# Altium schematic sheet H-BRIDGE.SchDoc
size A
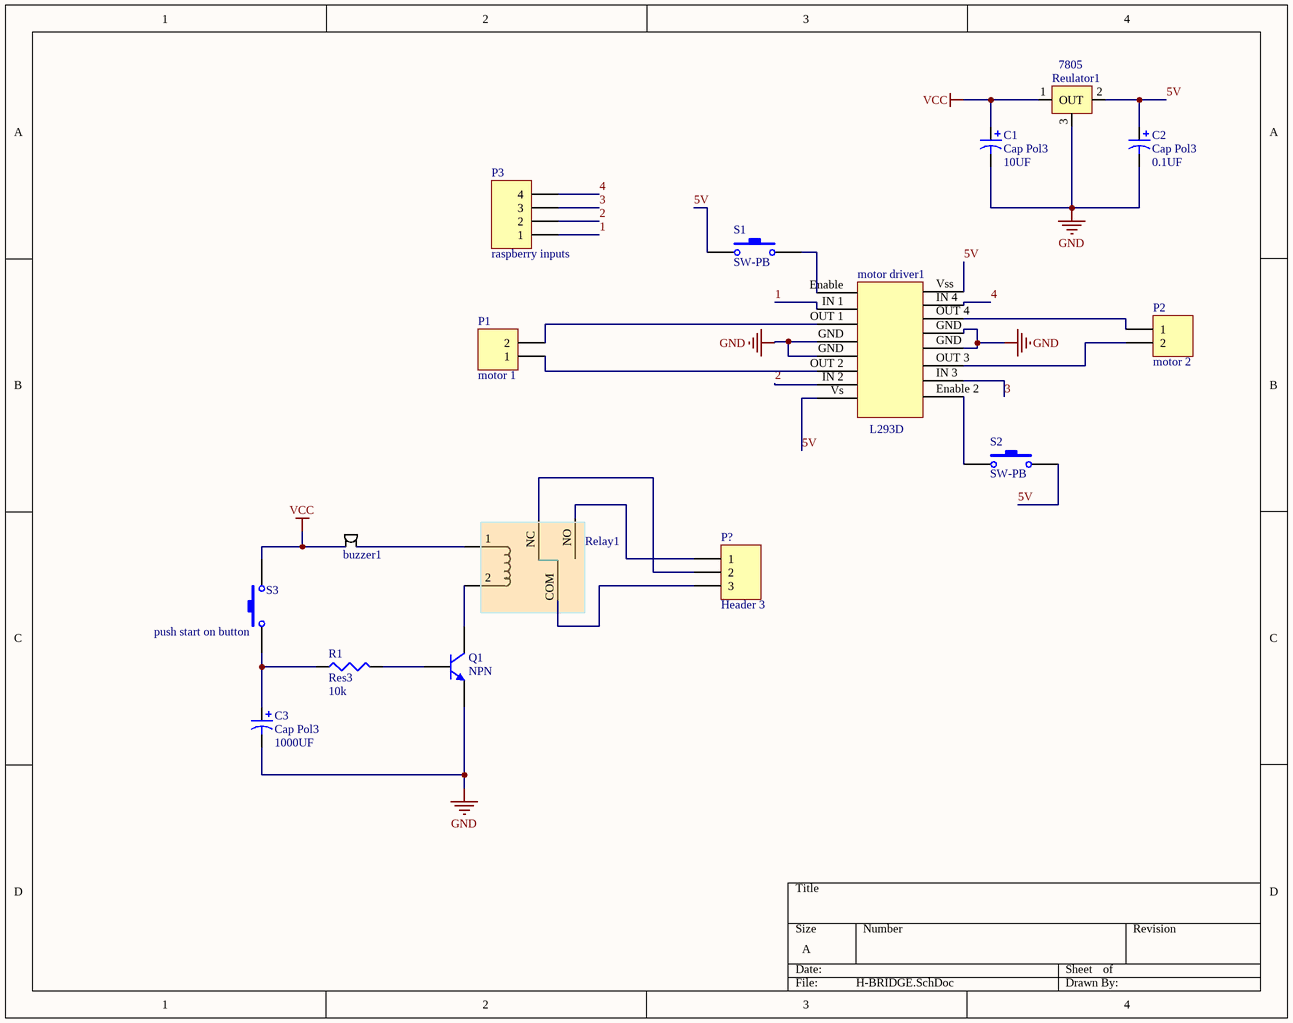
[diagram p0: H-BRIDGE.SchDoc]

## Parts
buzzer1  buzzer  [Buzzer]  (value not drawn)
C1  Cap Pol3  value 10UF  [C0805]
C2  Cap Pol3  value 0.1UF  [C0805]
C3  Cap Pol3  value 1000UF  [C0805]
motor_driver1  L293D  [L293D]
P1  motor 1  [HDR1X2]
P2  motor 2  [HDR1X2]
P3  raspberry inputs  [HDR1X4]
P?  Header 3  [HDR1X3]
Q1  NPN  [TO-226-AA]
R1  Res3  value 10k  [J1-0603]
Relay1  Realy 5v  [Relay 5v]  (value not drawn)
Reulator1  7805  [7805 REGULATOR]
S1  SW-PB  [SPST-2]
S2  SW-PB  [SPST-2]
S3  push start on button  [SPST-2]

## Nets
GND: C1.2 C2.2 C3.2 motor_driver1.GND Q1.3(E) Reulator1.3(BASE)
VCC: buzzer1.+ C1.1 Reulator1.1(IN) S3.2
1: motor_driver1.IN_1 P3.1
2: motor_driver1.IN_2 P3.2
3: motor_driver1.IN_3 P3.3
4: motor_driver1.IN_4 P3.4
5V: C2.1 motor_driver1.Vs motor_driver1.Vss Reulator1.2(OUT) S1.1 S2.2
Netbuzzer1_-: buzzer1.- Relay1.1(coil1)
NetC3_1: C3.1 R1.1 S3.1
Netmotor_driver1_Enable: motor_driver1.Enable S1.2
Netmotor_driver1_Enable 2: motor_driver1.Enable_2 S2.1
Netmotor_driver1_OUT 1: motor_driver1.OUT_1 P1.2
Netmotor_driver1_OUT 2: motor_driver1.OUT_2 P1.1
Netmotor_driver1_OUT 3: motor_driver1.OUT_3 P2.2
Netmotor_driver1_OUT 4: motor_driver1.OUT_4 P2.1
NetP?_1: P?.1 Relay1.NO
NetP?_2: P?.2 Relay1.NC
NetP?_3: P?.3 Relay1.COM
NetQ1_1: Q1.1(C) Relay1.2(coil2)
NetQ1_2: Q1.2(B) R1.2

## Library data of the parts
buzzer1 = buzzer: Magnetic NO 2700Hz 85dB @ 3V, 10cm 3V Φ9mm SMD Buzzers RoHS; created by: mohamed abdelsalam; chain Rule: https://lcsc.com/product-detail/Buzzers_FUET-FST-9045_C391040.html; Data Sheet: https://datasheet.lcsc.com/szlcsc/1912111437_FUET-FUET-9045_C391040.pdf
C1-C3 = Cap Pol3: Polarized Capacitor (Surface Mount); Published: 8-Jun-2000; LatestRevisionDate: 29-May-2009; LatestRevisionNote: IPC-7351 Footprint Added.; PackageReference: C0805; Publisher: Altium Limited; PackageDescription: Chip Capacitor
motor_driver1 = motor-L293D: DIP-16 Motor Drivers RoHS; supply chain: https://lcsc.com/product-detail/Motor-Drivers_STMicroelectronics_L293D_L293D_C12340.html; Data sheet: https://datasheet.lcsc.com/szlcsc/1811151537_STMicroelectronics-L293D_C12340.pdf
P1 P2 = Header 2: Header, 2-Pin; LatestRevisionDate: 17-Jul-2002; LatestRevisionNote: Re-released for DXP Platform.; Publisher: Altium Limited
P3 = Header 4: Header, 4-Pin; LatestRevisionDate: 17-Jul-2002; LatestRevisionNote: Re-released for DXP Platform.; Publisher: Altium Limited
P? = Header 3: Header, 3-Pin; LatestRevisionDate: 17-Jul-2002; LatestRevisionNote: Re-released for DXP Platform.; Publisher: Altium Limited
Q1 = NPN: NPN Bipolar Transistor; Published: 8-Jun-2000; LatestRevisionDate: 17-Jul-2002; LatestRevisionNote: Re-released for DXP Platform.; PackageReference: TO-226-AA; Publisher: Altium Limited; PackageDescription: TO, Flat Index; 3 In-Line, Axial Leads; Body Dia. 4.8mm; Leads 0.55 x 0.51 mm (max); Code_JEDEC: TO-226-AA
R1 = Res3: Resistor; Published: 8-Jun-2000; LatestRevisionDate: 29-May-2009; LatestRevisionNote: IPC-7351 Footprint Added.; PackageReference: J1-0603; Publisher: Altium Limited; PackageDescription: Chip Resistor
Relay1 = Realy 5v: General Purpose Non Latching 24VDC SPDT Through Hole Relays RoHS; Supply Chain: https://www.3dcontentcentral.com/secure/download-model.aspx?catalogid=171&id=871297; Data Sheet: https://datasheet.lcsc.com/szlcsc/1809211229_SANYOU-RELAYS-SRD-S-124D_C276435.pdf; created By: mohamed abdelsalam; Data: 3-10-2020
Reulator1 = 7805 Regulator
S1-S3 = SW-PB: Switch; Published: 24-Mar-1999; LatestRevisionDate: 17-Jul-2002; LatestRevisionNote: Re-released for DXP Platform.; PackageReference: SPST-2; Publisher: Altium Limited; PackageDescription: Switch; 2 Leads